# Altium schematic sheet PreciseGNSS.SchDoc
size A4; SheetNumber: 11; SheetTotal: 14
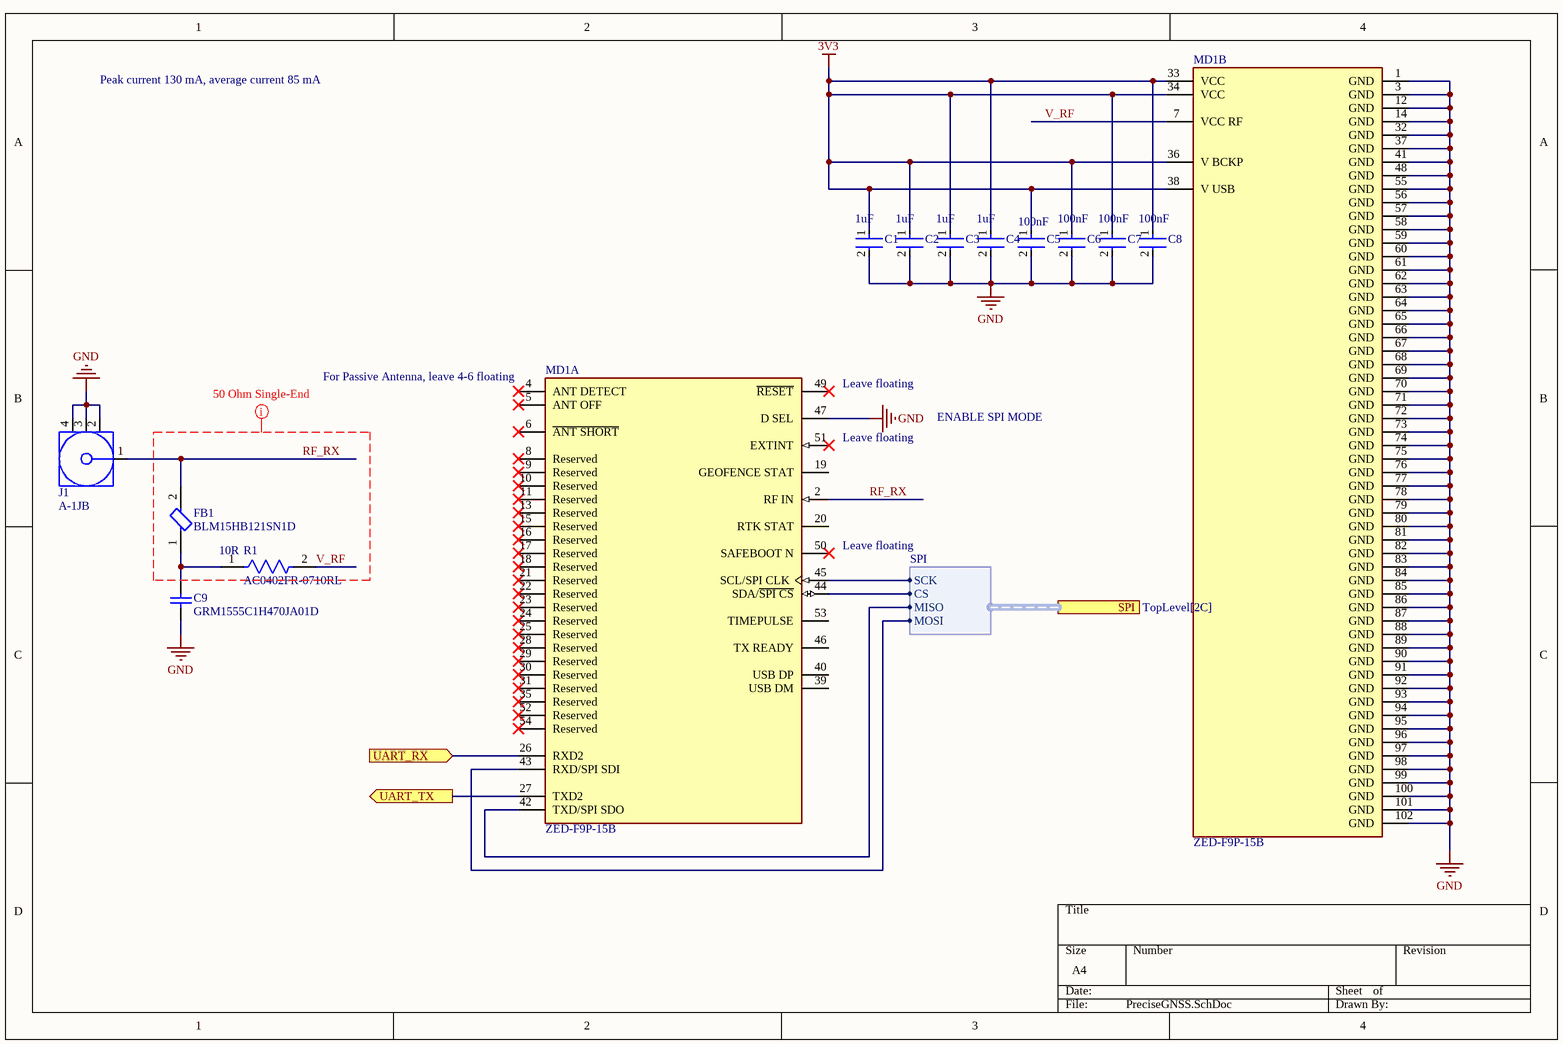
[diagram p0: PreciseGNSS.SchDoc]

## Parts
C1  Capacitance: 1uF  [FP-CL511-IPC_C]  (hidden comment: CL05A105KP5NNNC)
C2  Capacitance: 1uF  [FP-CL511-IPC_C]  (hidden comment: CL05A105KP5NNNC)
C3  Capacitance: 1uF  [FP-CL511-IPC_C]  (hidden comment: CL05A105KP5NNNC)
C4  Capacitance: 1uF  [FP-CL511-IPC_C]  (hidden comment: CL05A105KP5NNNC)
C5  Capacitance: 100nF  [FP-GRM155-0_05-IPC_C]  (hidden comment: GRM155R71E104KE14J)
C6  Capacitance: 100nF  [FP-GRM155-0_05-IPC_C]  (hidden comment: GRM155R71E104KE14J)
C7  Capacitance: 100nF  [FP-GRM155-0_05-IPC_C]  (hidden comment: GRM155R71E104KE14J)
C8  Capacitance: 100nF  [FP-GRM155-0_05-IPC_C]  (hidden comment: GRM155R71E104KE14J)
C9  GRM1555C1H470JA01D  [CAPC1005X55X25LL05T10]
FB1  BLM15HB121SN1D  [FP-BLM15-0_05-IPC_B]
J1  A-1JB  [AMPH-A-1JB_V]
MD1  ZED-F9P-15B  [FP-ZED-F9P-15B-MFG]  (parts A,B of 2)
R1  AC0402FR-0710RL  Resistance: 10R  [FP-AC0402-IPC_B]

## Ports
SPI (harness SPI, see TopLevel[2C]), UART_RX (in), UART_TX (out)

## Harnesses
SPI: SCK, MISO, MOSI, CS

## Nets
3V3: C1.1 C2.1 C3.1 C4.1 C5.1 C6.1 C7.1 C8.1 MD1.33(VCC) MD1.34(VCC) MD1.36(V_BCKP) MD1.38(V_USB)
GND: C1.2 C2.2 C3.2 C4.2 C5.2 C6.2 C7.2 C8.2 C9.1 J1.2 J1.3 J1.4 MD1.1(GND) MD1.3(GND) MD1.12(GND) MD1.14(GND) MD1.32(GND) MD1.37(GND) MD1.41(GND) MD1.47(D_SEL) MD1.48(GND) MD1.55(GND) MD1.56(GND) MD1.57(GND) MD1.58(GND) MD1.59(GND) MD1.60(GND) MD1.61(GND) MD1.62(GND) MD1.63(GND) MD1.64(GND) MD1.65(GND) MD1.66(GND) MD1.67(GND) MD1.68(GND) MD1.69(GND) MD1.70(GND) MD1.71(GND) MD1.72(GND) MD1.73(GND) MD1.74(GND) MD1.75(GND) MD1.76(GND) MD1.77(GND) MD1.78(GND) MD1.79(GND) MD1.80(GND) MD1.81(GND) MD1.82(GND) MD1.83(GND) MD1.84(GND) MD1.85(GND) MD1.86(GND) MD1.87(GND) MD1.88(GND) MD1.89(GND) MD1.90(GND) MD1.91(GND) MD1.92(GND) MD1.93(GND) MD1.94(GND) MD1.95(GND) MD1.96(GND) MD1.97(GND) MD1.98(GND) MD1.99(GND) MD1.100(GND) MD1.101(GND) MD1.102(GND)
RF_RX: FB1.2 J1.1 MD1.2(RF_IN)
UART_RX: MD1.26(RXD2) ; port UART_RX
UART_TX: MD1.27(TXD2) ; port UART_TX
V_RF: MD1.7(VCC_RF) R1.2
NetC9_2: C9.2 FB1.1 R1.1
NetMD1_42: MD1.42(TXD/SPI_SDO) ; port SPI.MISO
NetMD1_43: MD1.43(RXD/SPI_SDI) ; port SPI.MOSI
NetMD1_44: MD1.44(SDA/~{SPI_CS}) ; port SPI.CS
NetMD1_45: MD1.45(SCL/SPI_CLK) ; port SPI.SCK

Not connected (* = marked no-connect by the designer): MD1 4(ANT_DETECT)* 5(ANT_OFF)* 6(~{ANT_SHORT})* 8(Reserved)* 9(Reserved)* 10(Reserved)* 11(Reserved)* 13(Reserved)* 15(Reserved)* 16(Reserved)* 17(Reserved)* 18(Reserved)* 19(GEOFENCE_STAT) 20(RTK_STAT) 21(Reserved)* 22(Reserved)* 23(Reserved)* 24(Reserved)* 25(Reserved)* 28(Reserved)* 29(Reserved)* 30(Reserved)* 31(Reserved)* 35(Reserved)* 39(USB_DM) 40(USB_DP) 46(TX_READY) 49(~{RESET})* 50(SAFEBOOT_N)* 51(EXTINT)* 52(Reserved)* 53(TIMEPULSE) 54(Reserved)*

## Layout directives
net class 50SE: RF_RX, V_RF

## Notes on the sheet
- Peak current 130 mA, average current 85 mA
- (near MD1) For Passive Antenna, leave 4-6 floating
- (near MD1) Leave floating
- ENABLE SPI MODE

## Library data of the parts
C1-C4 = CMP-13271-001936-1: Cap Ceramic 1uF 10V X5R ±10% SMD 0402 +85°C Paper T/R; Depth: 0.5mm; Case Code (Imperial): 0402; Material: Ceramic; Mount: Surface Mount; Thickness: 0.022inch; Dielectric: X5R; Radiation Hardening: No; Case/Package: 0402; Length: 1mm; Tolerance: 10%; Max Operating Temperature: 85°C; Package Quantity: 1; Width: 0.02inch; Voltage Rating: 10V; Contact Plating: Tin; Height: 0.5mm; Min Operating Temperature: -55°C; Case Code (Metric): 1005; Packaging: Tape and Reel
C5-C8 = CMP-06035-003995-1: Chip Multilayer Ceramic Capacitors for General Purpose, 0402, 0.10uF, X7R, 15%, 10%, 25V; Resistor Type: Ceramic; Tolerance: 10%; Case Code (Metric): 1005; Termination: SMD/SMT; Mount: Surface Mount; Voltage Rating: 25V; Voltage Rating (DC): 25V; Case Code (Imperial): 0402; Max Operating Temperature: 125°C; Weight: 0.000212oz; Case/Package: 0402; Length: 0.039inch; Width: 0.5mm; Thickness: 0.022inch; Height: 0.5mm; Packaging: Tape and Reel; Package Quantity: 50000; Min Operating Temperature: -55°C; Dielectric: X7R
C9 = CMP-2008-04368-1: Manufacturer: Murata; Part Number: GRM1555C1H470JA01D
FB1 = CMP-0686-00154-4: Chip Ferrite Bead, 0402, 120Ω @ 100MHz, 0.7Ω, 25%, 300mA; Impedance: 120R; DC Resistance (DCR): 700mR; Number of Lines: 1; Material: Steel; Lead Free: Lead Free; Min Operating Temperature: -55°C; Package Quantity: 10000; Tolerance: 25%; REACH SVHC: No SVHC; Termination: SMD/SMT; Number of Pins: 2; Frequency: 100MHz; Weight: 2.3E-05oz; Test Frequency: 100MHz; Series: BLM15H; Max DC Current: 300mA; Packaging: Tape and Reel; Width: 0.5mm; Max Current Rating: 300mA; Height: 0.5mm; Depth: 0.55mm; Case Code (Imperial): 0402; RoHS Compliant: Yes; Max Operating Temperature: 125°C; Current Rating: 300mA; Case Code (Metric): 1005; Number of Circuits: 1; Length: 1mm; Case/Package: 0402
J1 = CMP-1743-00001-1: AMC PCB Jack, 0 to 60 GHz, 60 V, -40 to 90 degC, 4-Pin SMD, RoHS, Tape and Reel; Capacitance: 100 uF; Case\Package: 2917; Voltage Rating (DC): 10 V; ESR: 700 mohm; Tolerance: 10%; ComponentLink1Description: Datasheet; PackageDescription: 4-Pin Surface Mount Device, Body 2.6 x 2.6 mm; Radiation Hardening: No; Package Quantity: 1; REACH SVHC: No SVHC; DatasheetVersion: Rev. K, 05/2016; ComponentLink1URL: http://drawings.amphenolrf.com/Customer_Outline/CA-1JB.pdf; Pins: 2; Packaging: Tape and Reel; Min Operating Temperature: -55 degC; RoHSCompliant: true; Length: 7.3 mm; PackageReference: A-1JB; Weight: 0.023634 oz; Mount: Surface Mount; Voltage Rating: 10 V; Max Operating Temperature: 125 degC; Height: 3.1 mm; Case Code (Imperial): 2917; Case Code (Metric): 7343; Width: 4.3 mm
MD1 = CMP-07419-140268250-1: ZED-F9P-15B GNSS / GPS Modules u-blox F9 dual band L1/L5 GNSS module high precision Professi; Interface: I2C, SPI, UART, USB; Min Supply Voltage: 1.65V; Max Supply Voltage: 3.6V; Data Rate: 400kbps; NexarPartId: 140268250; Max Operating Temperature: 85°C; Height: 2.6mm; Min Operating Temperature: -40°C
R1 = CMP-2002-01791-3: RES 10Ω ±1% 0.063W 0402; Temperature Coefficient: 200ppm/°C; Power Rating: 62.5mW; Voltage Rating: 50V; Max Power Dissipation: 63mW; Min Operating Temperature: -55°C; Packaging: Tape and Reel; Number of Terminations: 2; Max Operating Temperature: 155°C; Size Code: 0402; Ratings: AEC-Q200; Tolerance: 1%; Resistor Type: Thick Film; Length: 1mm; Width: 0.5mm; Height: 0.32mm; Termination: SMD/SMT; Case/Package: 0402; Case Code (Metric): 1005; Lead Free: Lead Free; Features: Moisture Resistant; Series: AC; Case Code (Imperial): 0402